# Altium project 22-CAN.PrjPcb
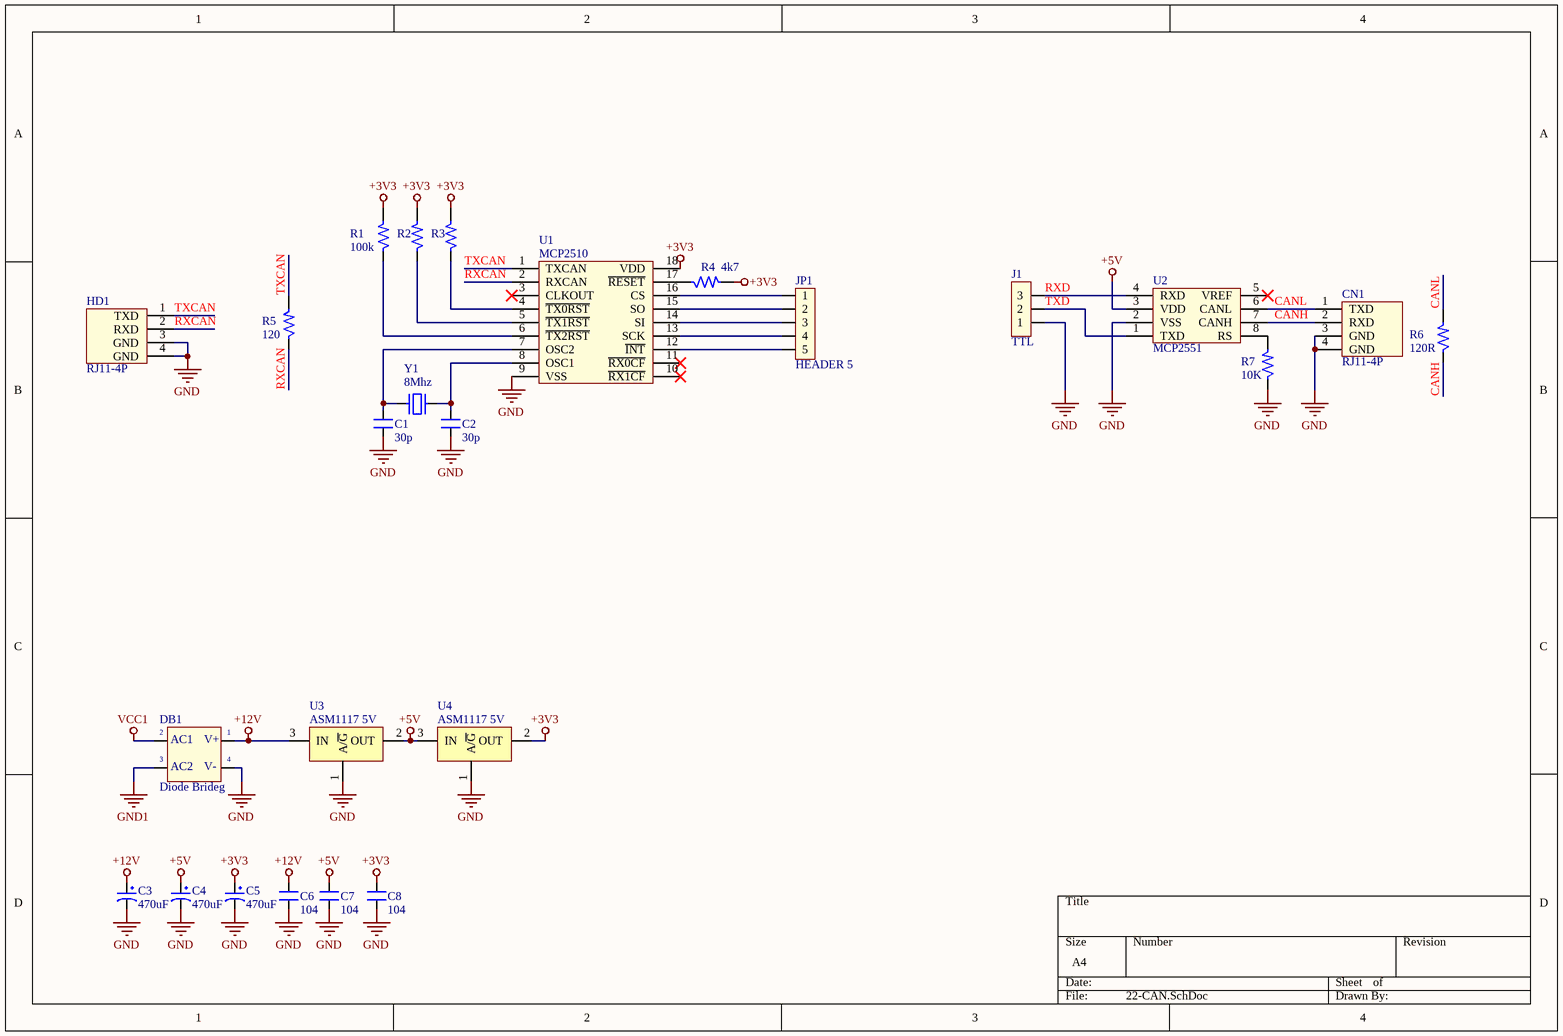
[diagram p0: 22-CAN.SchDoc]
1 sheet, 25 parts. Net scope: global (net labels, ports and power ports of the same name join across sheets).
Board file: 22-CAN.PcbDoc

## Sheet 22-CAN.SchDoc
size A4

### Parts
C1  30p  [C-0805]
C2  30p  [C-0805]
C3  470uF  [C-ALU-D6.5]
C4  470uF  [C-ALU-D6.5]
C5  470uF  [C-ALU-D6.5]
C6  104  [C-0805]
C7  104  [C-0805]
C8  104  [C-0805]
CN1  RJ11-4P
DB1  Diode Brideg  [D-DB-1A-SMD]
HD1  RJ11-4P
J1  TTL  [JP3]
JP1  HEADER 5  [JP5]
R1  100k  [R-0805]
R2  100k  [R-0805]  (value not drawn)
R3  100k  [R-0805]  (value not drawn)
R4  4k7  [R-0805]
R5  120  [R-0805]
R6  120R  [R-0805]
R7  10K  [R-0805]
U1  MCP2510  [SOIC-18-W]
U2  MCP2551  [SOIC-8]
U3  ASM1117 5V  [TO-252]
U4  ASM1117 5V  [TO-252]
Y1  8Mhz  [XTAL-AB38T-SMD]

### Nets
+3V3: C5.1 C8.2 R1.2 R2.2 R3.2 R4.2 U1.18(VDD) U4.2(OUT)
+5V: C4.1 C7.2 U2.3(VDD) U3.2(OUT) U4.3(IN)
+12V: C3.1 C6.2 DB1.3(AC2) U3.3(IN)
GND: C1.1 C2.1 C3.2 C4.2 C5.2 C6.1 C7.1 C8.1 CN1.3(GND) CN1.4(GND) DB1.4(-V_OUT) HD1.3(GND) HD1.4(GND) J1.1 R7.1 U1.9(VSS) U2.2(VSS) U3.1(A/~{G}) U4.1(A/~{G})
GND1: DB1.1(+V_OUT)
VCC1: DB1.2(AC1)
CANH: CN1.2(RXD) R6.1 U2.7(CANH)
CANL: CN1.1(TXD) R6.2 U2.6(CANL)
RXCAN: HD1.2(RXD) R5.1 U1.2(RXCAN)
RXD: J1.3 U2.4(RXD)
TXCAN: HD1.1(TXD) R5.2 U1.1(TXCAN)
TXD: J1.2 U2.1(TXD)
NetC1_2: C1.2 U1.7(OSC2) Y1.1
NetC2_2: C2.2 U1.8(OSC1) Y1.2
NetJP1_1: JP1.1 U1.16(CS)
NetJP1_2: JP1.2 U1.15(SO)
NetJP1_3: JP1.3 U1.14(SI)
NetJP1_4: JP1.4 U1.13(SCK)
NetJP1_5: JP1.5 U1.12(~{INT})
NetR1_1: R1.1 U1.6(~{TX2RST})
NetR2_1: R2.1 U1.5(~{TX1RST})
NetR3_1: R3.1 U1.4(~{TX0RST})
NetR4_1: R4.1 U1.17(~{RESET})
NetR7_2: R7.2 U2.8(RS)

Not connected (* = marked no-connect by the designer): U1 3(CLKOUT)* 10(~{RX1CF})* 11(~{RX0CF})*; U2 5(VREF)*

### Notes on the sheet
- (in symbol DB) V+; V-

### Library data of the parts
C1 C2 C6-C8 = CN: Value: 0,1uF/300V; Designed by: VanDungEvn
C3-C5 = CP1: Cap P  0,1uF < 22uF , 16 - 50V; Value: 10uF/50V; Description 1: 10 => 220uF/6,3V/10V - 10uF => 100uF/16V; Description 2: 0,1uF => 33uF/50V - 10uF => 22uF/63V; Description 3: 0,47uF => 10uF/100V
DB1 = DB: Convert AC to DC voltage, 4 pin; Value: Cau 1A
J1 = JP3: Jumper 3; Value: J3
JP1 = JP5
R1-R7 = R: Resistor 1/4W; Value: R1/4W - 1K
U3 U4 = ASM1117
Y1 = XTAL: Value: XT
CN1 HD1 = RJ11-4P: Value: RJ11-4P
U1 = MCP2510: Value: MCP2510
U2 = MCP2551: Value: MCP2551